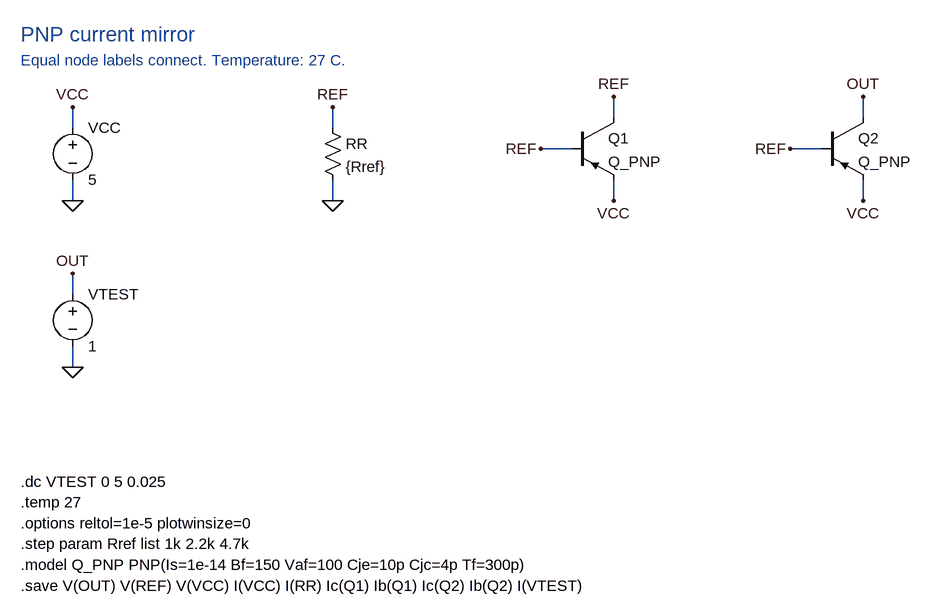
[diagram p0: schematic pnp-current-mirror.asc]
pnp-current-mirror.asc, the LTspice schematic file:
Version 4
SHEET 1 1740 1032
WIRE 144 176 144 144
WIRE 144 256 144 288
WIRE 544 176 544 144
WIRE 544 256 544 288
WIRE 976 160 976 128
WIRE 912 208 864 208
WIRE 976 256 976 288
WIRE 1360 160 1360 128
WIRE 1296 208 1248 208
WIRE 1360 256 1360 288
WIRE 144 432 144 400
WIRE 144 512 144 544
FLAG 144 144 VCC
FLAG 144 288 0
FLAG 544 144 REF
FLAG 544 288 0
FLAG 976 128 REF
FLAG 864 208 REF
FLAG 976 288 VCC
FLAG 1360 128 OUT
FLAG 1248 208 REF
FLAG 1360 288 VCC
FLAG 144 400 OUT
FLAG 144 544 0
SYMBOL voltage 144 160 R0
SYMATTR InstName VCC
SYMATTR Value 5
SYMBOL res 528 160 R0
SYMATTR InstName RR
SYMATTR Value {Rref}
SYMBOL pnp 912 160 R0
SYMATTR InstName Q1
SYMATTR Value Q_PNP
SYMBOL pnp 1296 160 R0
SYMATTR InstName Q2
SYMATTR Value Q_PNP
SYMBOL voltage 144 416 R0
SYMATTR InstName VTEST
SYMATTR Value 1
TEXT 64 32 Left 3 ;PNP current mirror
TEXT 64 72 Left 2 ;Equal node labels connect. Temperature: 27 C.
TEXT 64 720 Left 2 !.dc VTEST 0 5 0.025
TEXT 64 752 Left 2 !.temp 27
TEXT 64 784 Left 2 !.options reltol=1e-5 plotwinsize=0
TEXT 64 816 Left 2 !.step param Rref list 1k 2.2k 4.7k
TEXT 64 848 Left 2 !.model Q_PNP PNP(Is=1e-14 Bf=150 Vaf=100 Cje=10p Cjc=4p Tf=300p)
TEXT 64 880 Left 2 !.save V(OUT) V(REF) V(VCC) I(VCC) I(RR) Ic(Q1) Ib(Q1) Ic(Q2) Ib(Q2) I(VTEST)

The netlist it stands for:
* pnp-current-mirror.asc
VCC VCC 0 5
RR REF 0 {Rref}
Q1 REF REF VCC 0 Q_PNP
Q2 OUT REF VCC 0 Q_PNP
VTEST OUT 0 1
.model NPN NPN
.model PNP PNP
.lib standard.bjt
* PNP current mirror
* Equal node labels connect. Temperature: 27 C.
.dc VTEST 0 5 0.025
.temp 27
.options reltol=1e-5 plotwinsize=0
.step param Rref list 1k 2.2k 4.7k
.model Q_PNP PNP(Is=1e-14 Bf=150 Vaf=100 Cje=10p Cjc=4p Tf=300p)
.save V(OUT) V(REF) V(VCC) I(VCC) I(RR) Ic(Q1) Ib(Q1) Ic(Q2) Ib(Q2) I(VTEST)
.backanno
.end